# Altium schematic sheet [04] ETHERNET.SchDoc
size A3; SheetNumber: 5
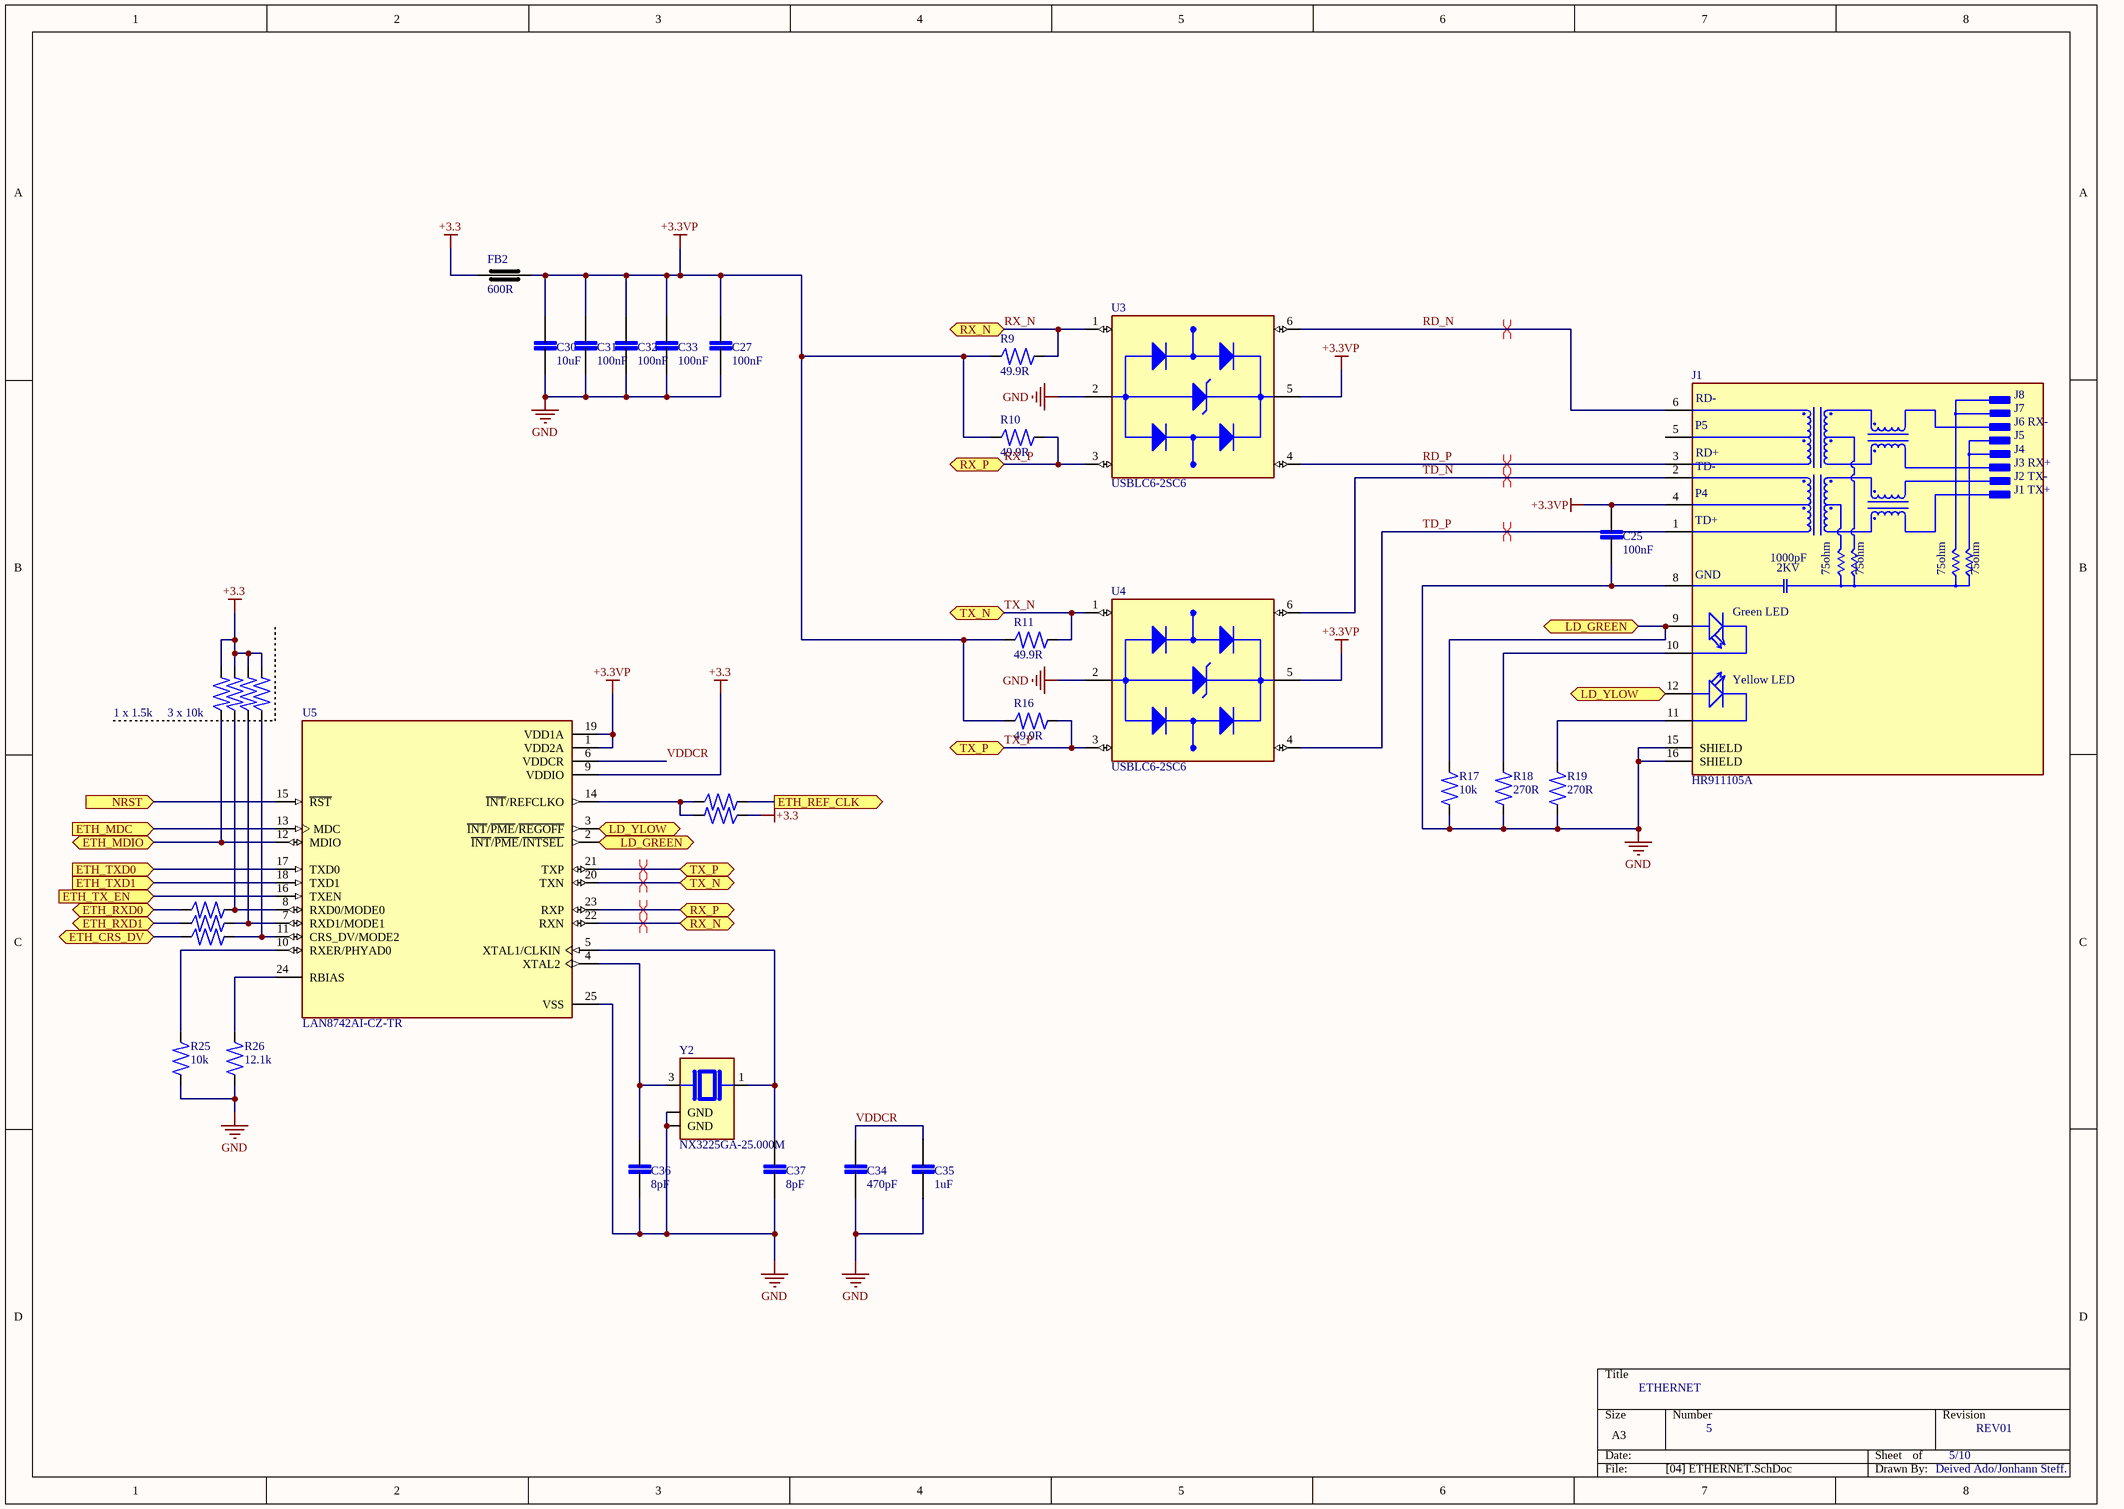
[diagram p0: [04] ETHERNET.SchDoc]

## Parts
C25  100nF  [cap_0603]
C27  100nF  [cap_0603]
C30  10uF  [cap_0603]
C31  100nF  [cap_0603]
C32  100nF  [cap_0603]
C33  100nF  [cap_0603]
C34  470pF  [cap_0603]
C35  1uF  [cap_0603]
C36  8pF  [cap_0603]
C37  8pF  [cap_0603]
FB2  600R  [res_0603]
J1  HR911105A  [HANRUN_HR911105A]
R9  49.9R  [res_0603]
R10  49.9R  [res_0603]
R11  49.9R  [res_0603]
R12  10k  [res_0603]  (value not drawn)
R13  10k  [res_0603]  (value not drawn)
R14  10k  [res_0603]  (value not drawn)
R15  10k  [res_0603]  (value not drawn)
R16  49.9R  [res_0603]
R17  10k  [res_0603]
R18  270R  [res_0603]
R19  270R  [res_0603]
R20  33R  [res_0603]  (value not drawn)
R21  10k  [res_0603]  (value not drawn)
R22  33R  [res_0603]  (value not drawn)
R23  33R  [RES_0603]  (value not drawn)
R24  33R  [res_0603]  (value not drawn)
R25  10k  [res_0603]
R26  12.1k  [res_0603]
U3  USBLC6-2SC6  [SOT95P280X145-6N]
U4  USBLC6-2SC6  [SOT95P280X145-6N]
U5  LAN8742AI-CZ-TR  [QFN50P400X400X100-25N]
Y2  NX3225GA-25.000M  [XTAL_NX3225SA-25.000M-STD-CRS-2]

## Ports
ETH_CRS_DV, ETH_MDC (in), ETH_MDIO (bidir), ETH_REF_CLK (out), ETH_RXD0 (bidir), ETH_RXD1 (bidir), ETH_TX_EN (in), ETH_TXD0 (in), ETH_TXD1 (in), LD_GREEN, LD_GREEN (out), LD_YLOW, LD_YLOW (out), NRST (in), RX_N, RX_P, TX_N (bidir), TX_P (bidir)

## Nets
+3.3: FB2.1 R12.1 R13.1 R14.1 R15.1 R21.2 U5.9(VDDIO)
+3.3VP: C25.1 C27.1 C30.1 C31.1 C32.1 C33.1 FB2.2 J1.4(P4) R9.2 R10.2 R11.2 R16.2 U3.5(VBUS) U4.5(VBUS) U5.1(VDD2A) U5.19(VDD1A)
GND: C25.2 C27.2 C30.2 C31.2 C32.2 C33.2 C34.2 C35.2 C36.1 C37.1 J1.8(GND) J1.15(SHIELD) J1.16(SHIELD) R17.1 R18.1 R19.1 R25.1 R26.1 U3.2(GND) U4.2(GND) U5.25(VSS) Y2.2(GND) Y2.4(GND)
ETH_CRS_DV: R24.2 ; port ETH_CRS_DV
ETH_MDC: U5.13(MDC) ; port ETH_MDC
ETH_MDIO: R12.2 U5.12(MDIO) ; port ETH_MDIO
ETH_REF_CLK: R20.1 ; port ETH_REF_CLK
ETH_RXD0: R22.2 ; port ETH_RXD0
ETH_RXD1: R23.2 ; port ETH_RXD1
ETH_TX_EN: U5.16(TXEN) ; port ETH_TX_EN
ETH_TXD0: U5.17(TXD0) ; port ETH_TXD0
ETH_TXD1: U5.18(TXD1) ; port ETH_TXD1
LD_GREEN: J1.9(GA) R17.2 U5.2(~{INT}/~{PME}/~{INTSEL}) ; port LD_GREEN
LD_YLOW: J1.12(YA) U5.3(~{INT}/~{PME}/~{REGOFF}) ; port LD_YLOW
NRST: U5.15(~{RST}) ; port NRST
RD_N: J1.6(RD-) U3.6(I/O1_OUT)
RD_P: J1.3(RD+) U3.4(I/O2_OUT)
RX_N: R9.1 U3.1(I/O1_IN) U5.22(RXN) ; port RX_N
RX_P: R10.1 U3.3(I/O2_IN) U5.23(RXP) ; port RX_P
TD_N: J1.2(TD-) U4.6(I/O1_OUT)
TD_P: J1.1(TD+) U4.4(I/O2_OUT)
TX_N: R11.1 U4.1(I/O1_IN) U5.20(TXN) ; port TX_N
TX_P: R16.1 U4.3(I/O2_IN) U5.21(TXP) ; port TX_P
VDDCR: C34.1 C35.1 U5.6(VDDCR)
NetC36_2: C36.2 U5.4(XTAL2) Y2.3
NetC37_2: C37.2 U5.5(XTAL1/CLKIN) Y2.1
NetJ1_10: J1.10(GC) R18.2
NetJ1_11: J1.11(YC) R19.2
NetR13_2: R13.2 R22.1 U5.8(RXD0/MODE0)
NetR14_2: R14.2 R23.1 U5.7(RXD1/MODE1)
NetR15_2: R15.2 R24.1 U5.11(CRS_DV/MODE2)
NetR20_2: R20.2 R21.1 U5.14(~{INT}/REFCLKO)
NetR25_2: R25.2 U5.10(RXER/PHYAD0)
NetR26_2: R26.2 U5.24(RBIAS)

Not connected (* = marked no-connect by the designer): J1 5(P5)

## Layout directives
differential pair: RD_N, RD_P, RX_N, RX_P, TD_N, TD_P, TX_N, TX_P

## Notes on the sheet
- 1 x 1.5k
- (near R12) 3 x 10k
- ETHERNET
- 5
- 5/10
- REV01
- Deived Ado/Jonhann Steff.
- (in symbol HR911105A) J8; J7; J6 RX-; J5; J4; J3 RX+; J2 TX-; J1 TX+; 1000pF; 2KV; 75ohm; Green LED; Yellow LED

## Library data of the parts
C25 C27 C30-C35 = C_Small: Generic capacitor symbol
C36 C37 = C_Small: Generic capacitor symbol; PN: 06035A8R0JAT2A
FB2 = FerriteBead_Small
J1 = HR911105A: DIP RJ45 Connector;; MF: hanrun; SnapEDA_Link: https://www.snapeda.com/parts/HR911105A/HanRun/view-part/?ref=snap; Package: None; MP: HR911105A; Check_prices: https://www.snapeda.com/parts/HR911105A/HanRun/view-part/?ref=eda; Price: None; Value: *; Availability: Not in stock
R9-R21 R25 = R_Small: Generic Resistor symbol
R22-R24 = R_Small: Resistores de Filme Espesso - SMD D11/CRCW0603 100 33R 1% ET6 e3; PN: CRCW060333R0FKEC
R26 = R_Small: Resistores de Filme Espesso - SMD 0603 Anti-Surge Res. 0.1%, 12.1Koh; PN: ERJ-PB3B1212V
U3 U4 = USBLC6-2SC6: 17V Clamp 5A (8/20Âµs) Ipp Tvs Diode Surface Mount SOT-23-6; MF: STMicroelectronics; Value: *; SnapEDA_Link: https://www.snapeda.com/parts/USBLC6-2SC6/STMicroelectronics/view-part/?ref=snap; Check_prices: https://www.snapeda.com/parts/USBLC6-2SC6/STMicroelectronics/view-part/?ref=eda; Purchase-URL: https://pricing.snapeda.com/search/part/USBLC6-2SC6/?ref=eda; Price: None; Availability: In Stock; Package: SOT-23-6 STMicroelectronics; MP: USBLC6-2SC6
U5 = LAN8742AI-CZ-TR: 1/1 Transceiver Full Ethernet 24-SQFN (4x4); MF: Microchip; MP: LAN8742AI-CZ-TR; SnapEDA_Link: https://www.snapeda.com/parts/LAN8742AI-CZ-TR/Microchip/view-part/?ref=snap; Availability: In Stock; Package: VFQFN-24 Microchip Technology; Purchase-URL: https://pricing.snapeda.com/search/part/LAN8742AI-CZ-TR/?ref=eda; Check_prices: https://www.snapeda.com/parts/LAN8742AI-CZ-TR/Microchip/view-part/?ref=eda; Value: *; Price: None
Y2 = NX3225GA: Â±20ppm Crystal 10pF 50 Ohms 4-SMD, No Lead; MP: NX3225GA-26MHZ-TI; MF: NDK America,; SnapEDA_Link: https://www.snapeda.com/parts/NX3225GA-26MHZ-TI/NDK+America%252C+Inc./view-part/?ref=snap; Price: None; Purchase-URL: https://pricing.snapeda.com/search/part/NX3225GA-26MHZ-TI/?ref=eda; Value: *; Availability: In Stock; Check_prices: https://www.snapeda.com/parts/NX3225GA-26MHZ-TI/NDK+America%252C+Inc./view-part/?ref=eda; Package: SMD-4 NDK